# Altium schematic sheet GPS.SchDoc
size A
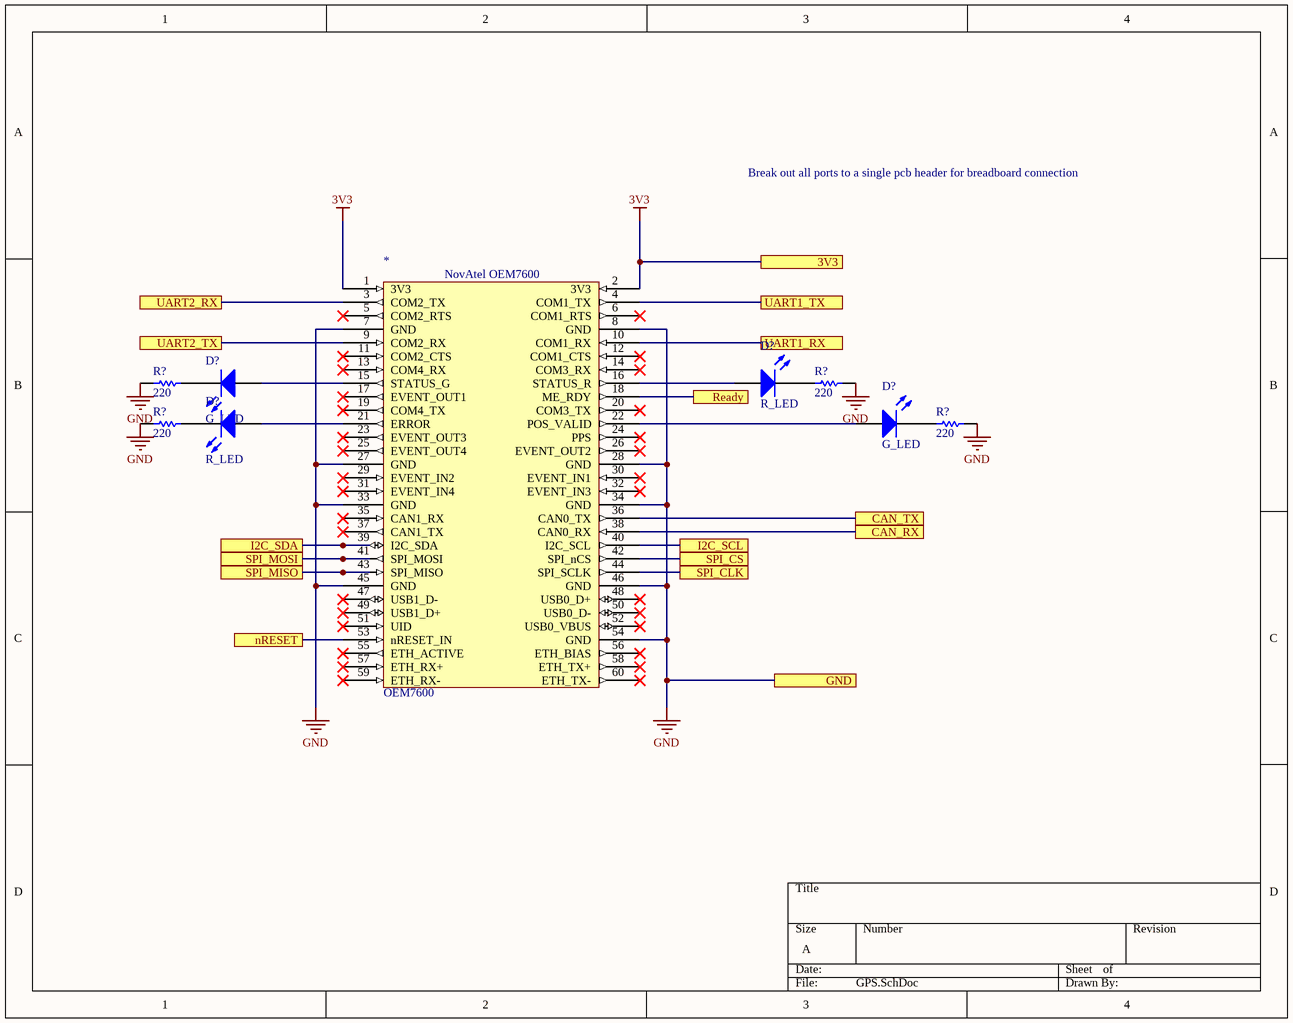
[diagram p0: GPS.SchDoc]

## Parts
(Parts that share a designator on the sheet are numbered #1, #2 ... from top to bottom, then left to right.)
*  OEM7600
D?#1  R_LED  [3.2X1.6X1.1]
D?#2  G_LED  [3.2X1.6X1.1]
D?#3  G_LED  [3.2X1.6X1.1]
D?#4  R_LED  [3.2X1.6X1.1]
R?#1  value 220  [AXIAL-0.3]  (hidden comment: Res1)
R?#2  value 220  [AXIAL-0.3]  (hidden comment: Res1)
R?#3  value 220  [AXIAL-0.3]  (hidden comment: Res1)
R?#4  value 220  [AXIAL-0.3]  (hidden comment: Res1)

## Ports
3V3, CAN_RX, CAN_TX, GND, I2C_SCL, I2C_SDA, nRESET, Ready, SPI_CLK, SPI_CS, SPI_MISO, SPI_MOSI, UART1_RX, UART1_TX, UART2_RX, UART2_TX

## Nets
3V3: *.1(3V3) *.2(3V3) ; port 3V3
GND: *.7(GND) *.8(GND) *.27(GND) *.28(GND) *.33(GND) *.34(GND) *.45(GND) *.46(GND) *.54(GND) R?#1.1 R?#2.2 R?#3.1 R?#4.2 ; port GND
CAN_RX: *.38(CAN0_RX) ; port CAN_RX
CAN_TX: *.36(CAN0_TX) ; port CAN_TX
I2C_SCL: *.40(I2C_SCL) ; port I2C_SCL
I2C_SDA: *.39(I2C_SDA) ; port I2C_SDA
nRESET: *.53(nRESET_IN) ; port nRESET
Ready: *.18(ME_RDY) ; port Ready
SPI_CLK: *.44(SPI_SCLK) ; port SPI_CLK
SPI_CS: *.42(SPI_nCS) ; port SPI_CS
SPI_MISO: *.43(SPI_MISO) ; port SPI_MISO
SPI_MOSI: *.41(SPI_MOSI) ; port SPI_MOSI
UART1_RX: *.10(COM1_RX) ; port UART1_RX
UART1_TX: *.4(COM1_TX) ; port UART1_TX
UART2_RX: *.3(COM2_TX) ; port UART2_RX
UART2_TX: *.9(COM2_RX) ; port UART2_TX
Net*_15: *.15(STATUS_G) D?#2.1(A)
Net*_16: *.16(STATUS_R) D?#1.1(A)
Net*_21: *.21(ERROR) D?#4.1(A)
Net*_22: *.22(POS_VALID) D?#3.1(A)
NetD?#1_2: D?#1.2(K) R?#2.1
NetD?#2_2: D?#2.2(K) R?#1.2
NetD?#3_2: D?#3.2(K) R?#4.1
NetD?#4_2: D?#4.2(K) R?#3.2

Not connected (* = marked no-connect by the designer): * 5(COM2_RTS)* 6(COM1_RTS)* 11(COM2_CTS)* 12(COM1_CTS)* 13(COM4_RX)* 14(COM3_RX)* 17(EVENT_OUT1)* 19(COM4_TX)* 20(COM3_TX)* 23(EVENT_OUT3)* 24(PPS)* 25(EVENT_OUT4)* 26(EVENT_OUT2)* 29(EVENT_IN2)* 30(EVENT_IN1)* 31(EVENT_IN4)* 32(EVENT_IN3)* 35(CAN1_RX)* 37(CAN1_TX)* 47(USB1_D-)* 48(USB0_D+)* 49(USB1_D+)* 50(USB0_D-)* 51(UID)* 52(USB0_VBUS)* 55(ETH_ACTIVE)* 56(ETH_BIAS)* 57(ETH_RX+)* 58(ETH_TX+)* 59(ETH_RX-)* 60(ETH_TX-)*

## Notes on the sheet
- Break out all ports to a single pcb header for breadboard connection
- (in symbol OEM7600) NovAtel OEM7600

## Library data of the parts
D?#1-D?#4 = LED2: Typical RED, GREEN, YELLOW, AMBER GaAs LED; Published: 8-Jun-2000; LatestRevisionDate: 17-Jul-2002; LatestRevisionNote: Re-released for DXP Platform.; PackageVersion: Feb-2002; PackageReference: 3.2X1.6X1.1; Publisher: Altium Limited; PackageDescription: SM LED; 2 Flat Leads
R?#1-R?#4 = Res1: Resistor; Published: 8-Jun-2000; LatestRevisionDate: 17-Jul-2002; LatestRevisionNote: Re-released for DXP Platform.; PackageReference: AXIAL-0.3; Publisher: Altium Limited; PackageDescription: Axial Device, Thru-Hole; 2 Leads; 0.3 in Pin Spacing
* = OEM7600: ComponentLink1Description: Connector Sheet; ComponentLink1URL: https://docs.novatel.com/OEM7/Content/Technical_Specs_Receiver/OEM7600_Interface_Connector.htm